# EAGLE schematic AcceLog_v00 (EAGLE 7.4.0)
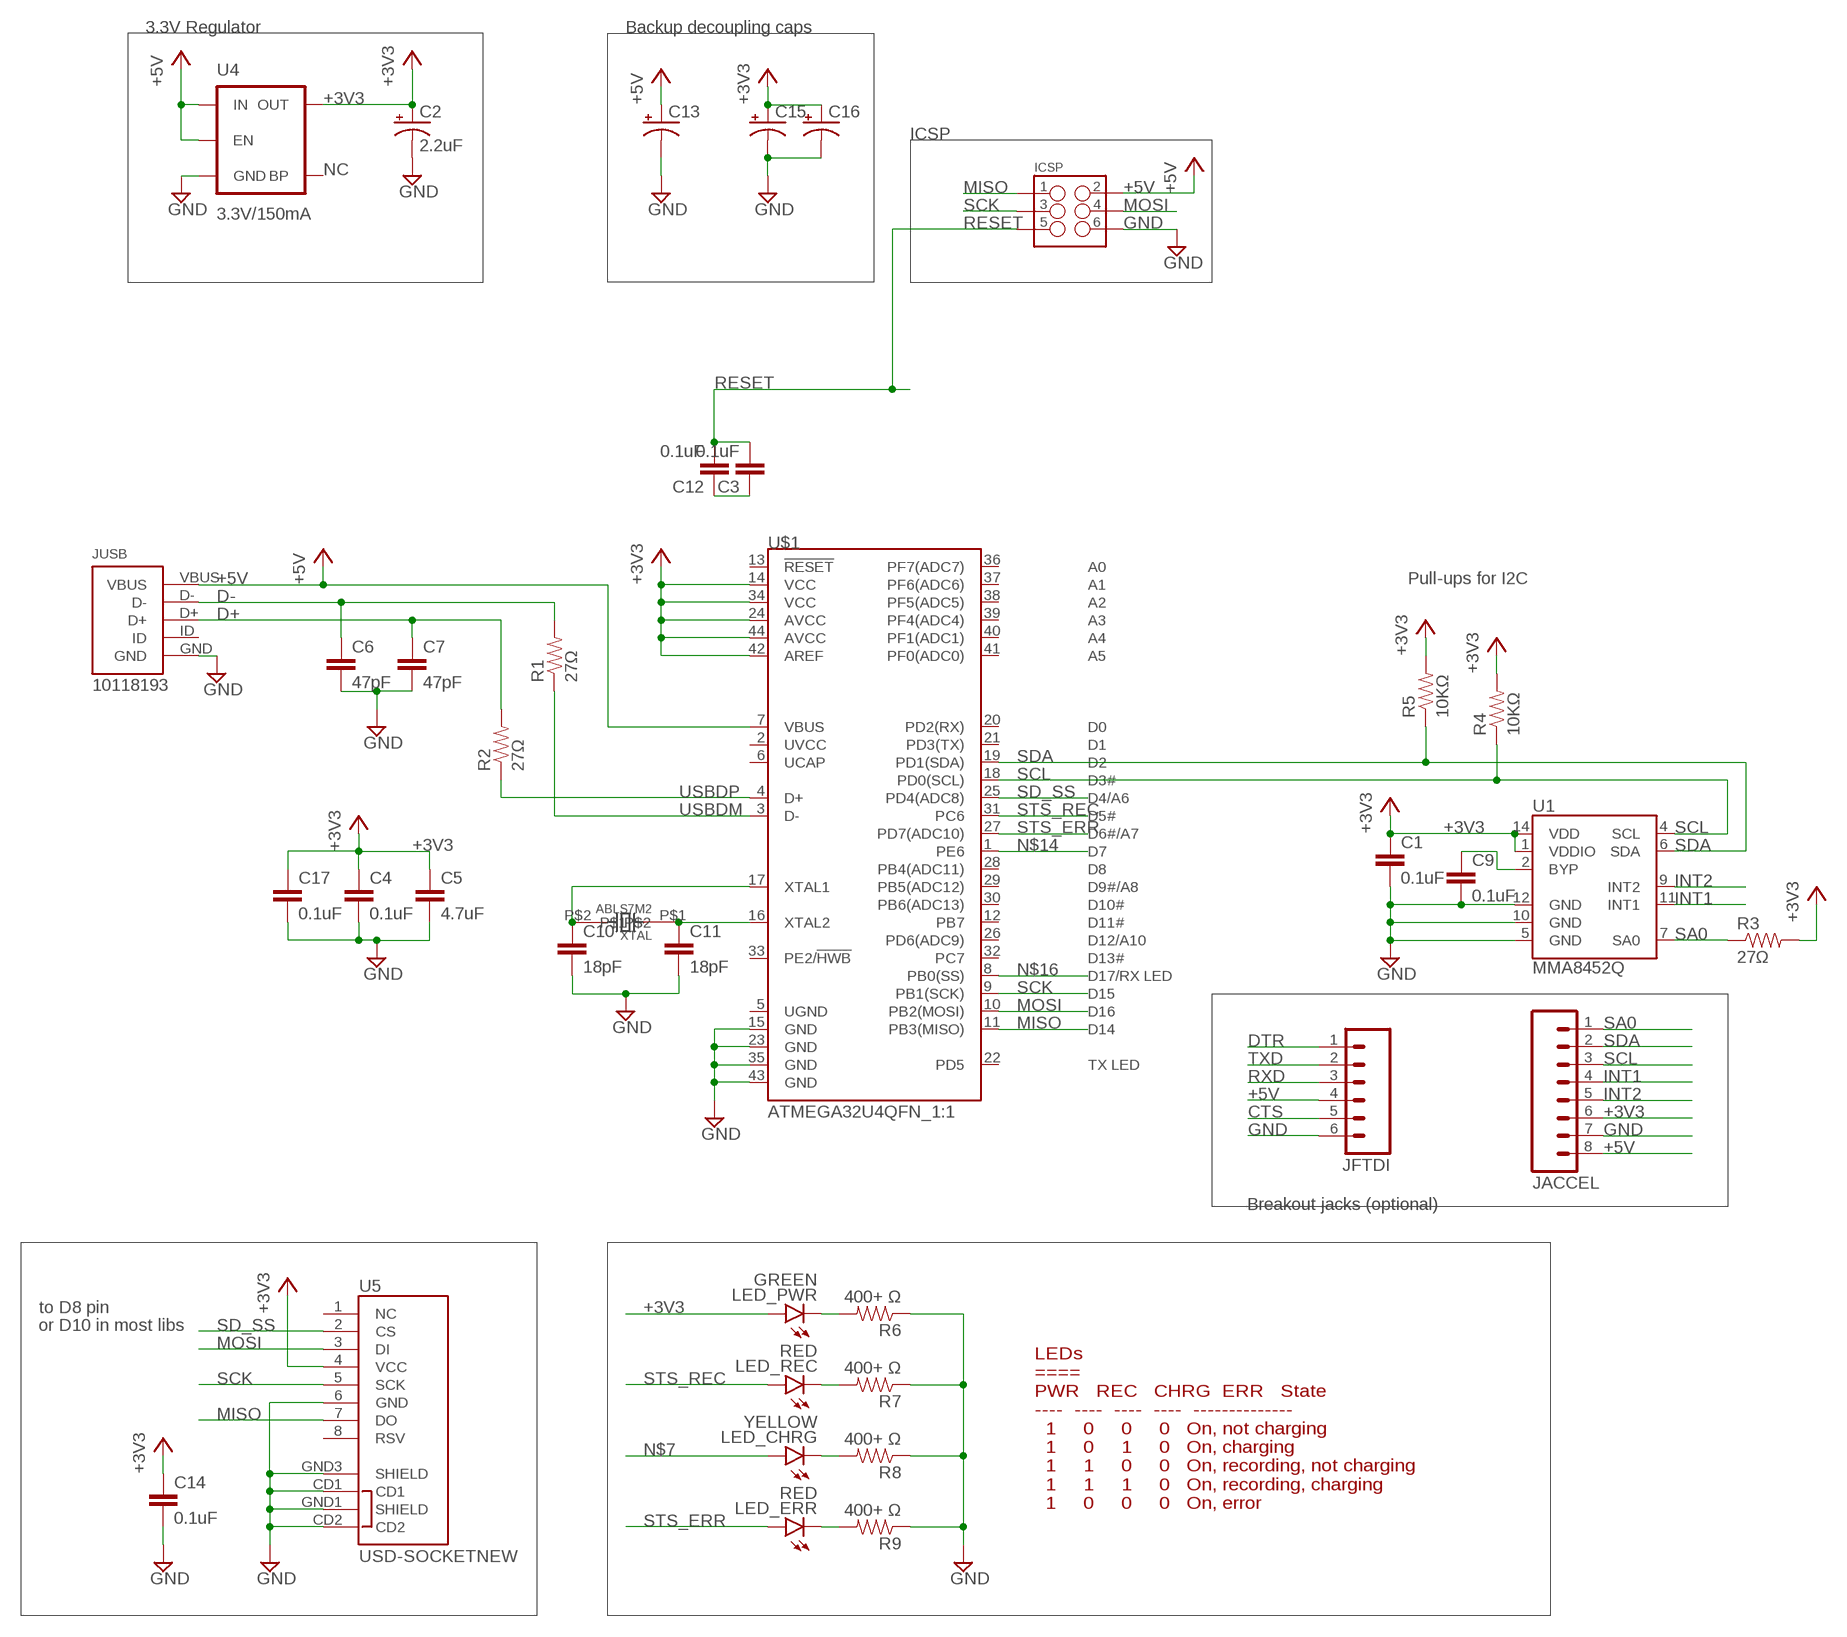
[diagram p0: schematic, sheet 1]

## Parts
C1  0.1uF  CAP0603-CAP  [0603-CAP]
C2  2.2uF  CAP_POL1206  [EIA3216]
C3  0.1uF  CAP0603-CAP  [0603-CAP]
C4  0.1uF  CAP0603-CAP  [0603-CAP]
C5  4.7uF  CAP0603-CAP  [0603-CAP]
C6  47pF  CAP0603-CAP  [0603-CAP]
C7  47pF  CAP0603-CAP  [0603-CAP]
C9  0.1uF  CAP0603-CAP  [0603-CAP]
C10  18pF  CAP0603-CAP  [0603-CAP]
C11  18pF  CAP0603-CAP  [0603-CAP]
C12  0.1uF  CAP0603-CAP  [0603-CAP]
C13  CPOL-USE2-5  [E2-5]
C14  0.1uF  CAP0603-CAP  [0603-CAP]
C15  CPOL-USE2-5  [E2-5]
C16  CPOL-USE2-5  [E2-5]
C17  0.1uF  CAP0603-CAP  [0603-CAP]
ICSP  M03X22X3_SILK_MALE_PTH  [2X3]
JACCEL  M08LOCK  [1X08_LOCK]
JFTDI  M06LOCK  [1X06_LOCK]
JUSB  10118193  [10118193]
LED_CHRG  YELLOW  LED0603  [LED-0603]
LED_ERR  RED  LED0603  [LED-0603]
LED_PWR  GREEN  LED0603  [LED-0603]
LED_REC  RED  LED0603  [LED-0603]
R1  27Ω  RESISTOR0603-RES  [0603-RES]
R2  27Ω  RESISTOR0603-RES  [0603-RES]
R3  27Ω  RESISTOR0603-RES  [0603-RES]
R4  10KΩ  RESISTOR0603-RES  [0603-RES]
R5  10KΩ  RESISTOR0603-RES  [0603-RES]
R6  400+ Ω  RESISTOR0603-RES  [0603-RES]
R7  400+ Ω  RESISTOR0603-RES  [0603-RES]
R8  400+ Ω  RESISTOR0603-RES  [0603-RES]
R9  400+ Ω  RESISTOR0603-RES  [0603-RES]
U1  MMA8452Q  [QFN-16_0.5MM]
U4  3.3V/150mA  V_REG_MIC52053.3V  [SOT23-5]
U5  USD-SOCKETNEW  [MICRO-SD-SOCKET-PP]
U$1  ATMEGA32U4QFN_1:1  [QFN-44-NOPAD_1:1]
XTAL  ABLS7M2  [ABLS7M2]

## Nets
+3V3: C1.1 C2.A(+) C4.1 C5.1 C14.1 C15.+ C16.+ C17.1 JACCEL.6 LED_PWR.A R3.2 R4.2 R5.2 U1.1(VDDIO) U1.14(VDD) U4.5(OUT) U5.4(VCC) U$1.14(VCC) U$1.24(AVCC) U$1.34(VCC) U$1.42(AREF) U$1.44(AVCC)
+5V: C13.+ ICSP.2 JACCEL.8 JFTDI.4 JUSB.VBUS U4.1(IN) U4.3(EN) U$1.7(VBUS)
CTS: JFTDI.5
D+: C7.1 JUSB.D+ R2.2
D-: C6.1 JUSB.D- R1.2
DTR: C3.1 C12.1 JFTDI.1
GND: C1.2 C2.C(-) C4.2 C5.2 C6.2 C7.2 C9.2 C10.2 C11.2 C13.- C14.2 C15.- C16.- C17.2 ICSP.6 JACCEL.7 JFTDI.6 JUSB.GND R6.1 R7.1 R8.1 R9.1 U1.5(GND) U1.10(GND) U1.12(GND) U4.2(GND) U5.6(GND) U5.CD1 U5.CD2 U5.GND1(SHIELD) U5.GND3(SHIELD) U$1.15(GND) U$1.23(GND) U$1.35(GND) U$1.43(GND)
INT1: JACCEL.4 U1.11(INT1)
INT2: JACCEL.5 U1.9(INT2)
MISO: ICSP.1 U5.7(DO) U$1.11(PB3(MISO))
MOSI: ICSP.4 U5.3(DI) U$1.10(PB2(MOSI))
N$2: LED_PWR.C R6.2
N$3: LED_REC.C R7.2
N$4: LED_CHRG.C R8.2
N$5: LED_ERR.C R9.2
N$7: LED_CHRG.A
N$10: C10.1 U$1.17(XTAL1) XTAL.P$2
N$11: C9.1 U1.2(BYP)
N$12: C11.1 U$1.16(XTAL2) XTAL.P$1
N$14: U$1.1(PE6)
N$16: U$1.8(PB0(SS))
RESET: C3.2 C12.2 ICSP.5
RXD: JFTDI.3
SA0: JACCEL.1 R3.1 U1.7(SA0)
SCK: ICSP.3 U5.5(SCK) U$1.9(PB1(SCK))
SCL: JACCEL.3 R4.1 U1.4(SCL) U$1.18(PD0(SCL))
SD_SS: U5.2(CS) U$1.25(PD4(ADC8))
SDA: JACCEL.2 R5.1 U1.6(SDA) U$1.19(PD1(SDA))
STS_ERR: LED_ERR.A U$1.27(PD7(ADC10))
STS_REC: LED_REC.A U$1.31(PC6)
TXD: JFTDI.2
USBDM: R1.1 U$1.3(D-)
USBDP: R2.1 U$1.4(D+)
Unconnected: JUSB.ID U4.4(BP) U5.1(NC) U5.8(RSV) U$1.2(UVCC) U$1.5(UGND) U$1.6(UCAP) U$1.12(PB7) U$1.13(!RESET) U$1.20(PD2(RX)) U$1.21(PD3(TX)) U$1.22(PD5) U$1.26(PD6(ADC9)) U$1.28(PB4(ADC11)) U$1.29(PB5(ADC12)) U$1.30(PB6(ADC13)) U$1.32(PC7) U$1.33(PE2/!HWB) U$1.36(PF7(ADC7)) U$1.37(PF6(ADC6)) U$1.38(PF5(ADC5)) U$1.39(PF4(ADC4)) U$1.40(PF1(ADC1)) U$1.41(PF0(ADC0))

## Notes on the sheet
- 3.3V Regulator | Backup decoupling caps
- ICSP
- NC
- Pull-ups for I2C
- Breakout jacks (optional)
- to D8 pin
- or D10 in most libs
- LEDs
  ====
  PWR   REC   CHRG  ERR   State
  ----  ----  ----  ----  --------------
    1     0     0     0   On, not charging
    1     0     1     0   On, charging
    1     1     0     0   On, recording, not charging
    1     1     1     0   On, recording, charging
    1     0     0     0   On, error

## Library data of the parts
C1 C3-C7 C9-C12 C14 C17 = SparkFun-Passives:CAP: Capacitor Standard 0603 ceramic capacitor, and 0.1" leaded capacitor.
C2 = SparkFun-Capacitors:CAP_POL: Capacitor Polarized These are standard SMD and PTH capacitors. Normally 10uF, 47uF, and 100uF in electrolytic and tantalum varieties. Always verify the external diameter of the through hole cap, it varies with capacity, voltage, and manufacturer. The EIA devices should be standard.
C13 C15 C16 = rcl:CPOL-US: POLARIZED CAPACITOR, American symbol
ICSP = SparkFun-Connectors:M03X2: 2x3 .1" header. Shrouded, with keying- CONN-10681 SMT- CONN-11415 Pogo pins- HW-11044; PROD_ID: CONN-09701
JACCEL = SparkFun-Connectors:M08: Header 8 Standard 8-pin 0.1" header. Use with straight break away headers (SKU : PRT-00116), right angle break away headers (PRT-00553), swiss pins (PRT-00743), machine pins (PRT-00117), and female headers (PRT-00115).
JFTDI = SparkFun-Connectors:M06: Header 6 Standard 6-pin 0.1" header. Use with straight break away headers (SKU : PRT-00116), right angle break away headers (PRT-00553), swiss pins (PRT-00743), machine pins (PRT-00117), and female headers (PRT-00115). Molex polarized connector foot print use with SKU : PRT-08094 with associated crimp pins and housings. NOTES ON THE VARIANTS LOCK and LOCK_LONGPADS... This footprint was designed to help hold the alignment of a through-hole component (i.e. 6-pin header) while soldering it into place. You may notice that each hole has been shifted either up or down by 0.005 of an inch from it's more standard position (which is a perfectly straight line). This slight alteration caused the pins (the squares in the middle) to touch the edges of the holes. Because they are alternating, it causes a "brace" to hold the component in place. 0.005 has proven to be the perfect amount of "off-center" position when using our standard breakaway headers. Although looks a little odd when you look at the bare footprint, once you have a header in there, the alteration is very hard to notice. Also,if you push a header all the way into place, it is covered up entirely on the bottom side. This idea of altering the position of holes to aid alignment will be further integrated into the Sparkfun Library for other footprints. It can help hold any component with 3 or more connection pins.
JUSB = MicroUSB:10118193: Micro USB B Jack for Surface Mount; MPN: 10118193; OC_DIGIKEY: 609-4616-1-ND; WEBSITE: http://www.digikey.com/product-detail/en/10118193-0001LF/609-4616-1-ND/2785380
LED_CHRG LED_ERR LED_PWR LED_REC = SparkFun-LED:LED: LEDs Standard schematic elements and footprints for 5mm, 3mm, 1206, and 0603 sized LEDs. 5mm - Spark Fun Electronics SKU : COM-00529 (and others)
R1-R9 = SparkFun-Passives:RESISTOR: Resistor Basic schematic elements and footprints for 0603, 1206, and PTH resistors.
U1 = SparkFun-Sensors:MMA8452Q: MMA8452Q 3-Axis, 12/8-bit Digital Accelerometer Supply Voltage: 1.6-3.6V Range: +/- 2g, 4g, 8g Interface: I2C, 12-bit and 8-bit ODR: 1.56 Hz - 800 Hz Package: QFN-16 http://cache.freescale.com/files/sensors/doc/data_sheet/MMA8452Q.pdf; PROD_ID: IC-10769
U4 = SparkFun-PowerIC:V_REG_MIC5205: V_REG MIC5205 Standard 3.3V, 5V, and Adjustable 150mA LDO voltage regulator in SOT-23 layout. Micrel part MIC5205. BP (by-pass) pin is used to lower output noise with 470pF cap, may be left open. On the adjustable version BP is used to set output.; PROD_ID: VREG-00822
U5 = SparkFun-Connectors:USD-SOCKET: microSD Socket Push-push type uSD socket. Schematic element and footprint production proven. Spark Fun Electronics SKU : PRT-00127. tDoc lines correctly indicate media card edge positions when inserting (unlocked, locked, depressed). NOTE: CD1 and CD2 are connected internally; PROD_ID: CONN-07820
U$1 = SparkFun-Retired:ATMEGA32U4: Atmel 44-pin 8-bit Microcontroller with 32KBytes of ISP Flash and USB Controller ----- Please use the QFN-44-NOPAD_1:1 package for the footprint of all boards using a 32U4. Route traces directly away from the pads as much as possible.
XTAL = AcceLogLib:ABLS7M2; DIGIKEY: 535-12830-1-ND; WEBSITE: http://www.digikey.com/product-detail/en/ABLS7M2-16.000MHZ-D-2Y-T/535-12830-1-ND/5135076